# Altium schematic sheet Page08 CPU MISC.SchDoc
size 297 x 209 mm
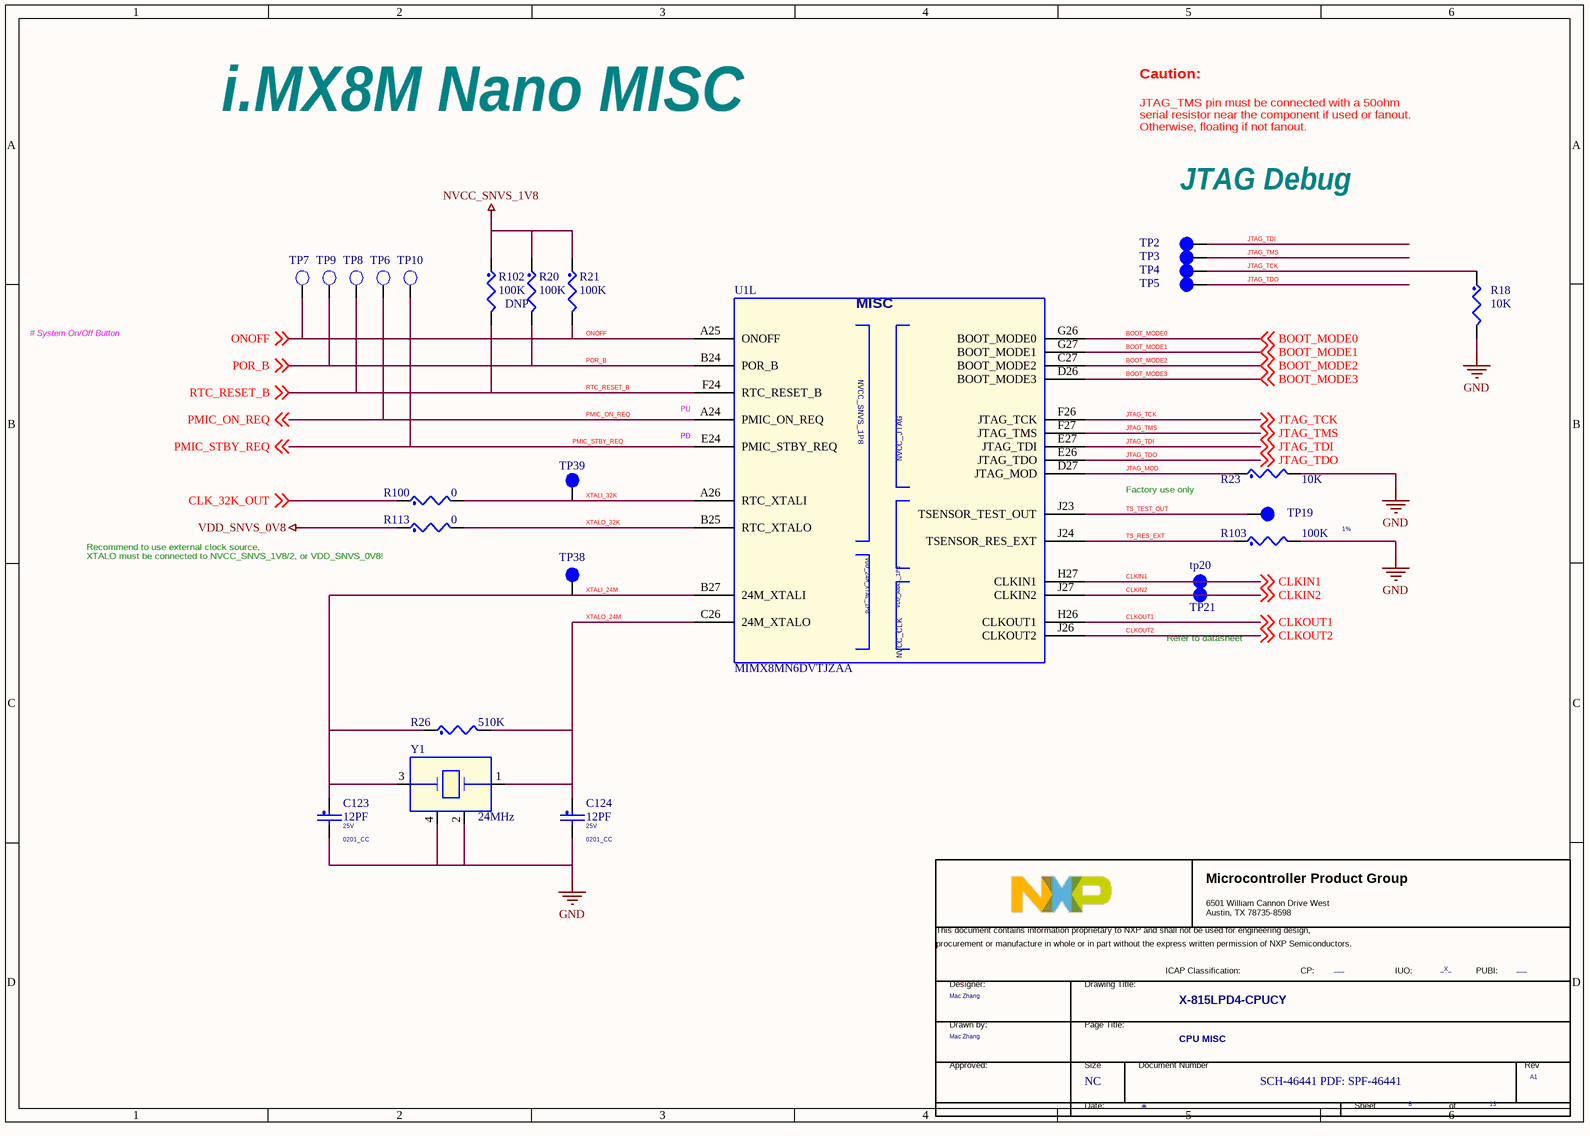
[diagram p0: Page08 CPU MISC.SchDoc]

## Parts
*  Doc: SCH-46441 PDF: SPF-46441  RevCode: A1  Title: X-815LPD4-CPUCY  Page Size: NC  Page Number: 8  Page Count: 13  PageTitle: CPU MISC  Designer: Mac Zhang  PUBI: ___  FIUO: _X_  (hidden comment: TitleBlock_MCPG)  (graphical)
C123  12PF  VOLTAGE: 25V  [0201_CC]
C124  12PF  VOLTAGE: 25V  [0201_CC]
R18  10K  [0201_CC]
R20  100K  [0201_CC]
R21  100K  [0201_CC]
R23  10K  [0201_CC]
R26  510K  [0402_CC]
R100  0  [0402_CC]
R102  100K  ASSY_OPT: DNP  [0201_CC]
R103  100K  Tolerance: 1%  [0201_CC]
R113  0  [0402_CC]
TP2  tpad_020  [tpad_020]  (value not drawn)
TP3  tpad_020  [tpad_020]  (value not drawn)
TP4  tpad_020  [tpad_020]  (value not drawn)
TP5  tpad_020  [tpad_020]  (value not drawn)
TP6  TP_35MIL  [testpoint_35mil]  (value not drawn)
TP7  TP_35MIL  [testpoint_35mil]  (value not drawn)
TP8  TP_35MIL  [testpoint_35mil]  (value not drawn)
TP9  TP_35MIL  [testpoint_35mil]  (value not drawn)
TP10  TP_35MIL  [testpoint_35mil]  (value not drawn)
TP19  tpad_020  [tpad_020]  (value not drawn)
tp20  tpad_020  [tpad_020]  (value not drawn)
TP21  tpad_020  [tpad_020]  (value not drawn)
TP38  tpad_020  [tpad_020]  (value not drawn)
TP39  tpad_020  [tpad_020]  (value not drawn)
U1  MIMX8MN6DVTJZAA  [bga486_0p5_14x14]  (part L of 14)
Y1  24MHz  [xtlosc4_3p2x2p5mm_sm]

## Nets
GND: C123.2 C124.2 R18.2 R23.2 R103.2 Y1.2 Y1.4
NVCC_SNVS_1V8: R20.1 R21.1 R102.1
VDD_SNVS_0V8: R113.1
BOOT_MODE0: U1.G26(BOOT_MODE0) ; off-sheet BOOT_MODE0
BOOT_MODE1: U1.G27(BOOT_MODE1) ; off-sheet BOOT_MODE1
BOOT_MODE2: U1.C27(BOOT_MODE2) ; off-sheet BOOT_MODE2
BOOT_MODE3: U1.D26(BOOT_MODE3) ; off-sheet BOOT_MODE3
CLK_32K_OUT: R100.1 ; off-sheet CLK_32K_OUT
CLKIN1: tp20.1(Pin1) U1.H27(CLKIN1) ; off-sheet CLKIN1
CLKIN2: TP21.1(Pin1) U1.J27(CLKIN2) ; off-sheet CLKIN2
CLKOUT1: U1.H26(CLKOUT1) ; off-sheet CLKOUT1
CLKOUT2: U1.J26(CLKOUT2) ; off-sheet CLKOUT2
JTAG_MOD: R23.1 U1.D27(JTAG_MOD)
JTAG_TCK: R18.1 TP4.1(Pin1) U1.F26(JTAG_TCK) ; off-sheet JTAG_TCK
JTAG_TDI: TP2.1(Pin1) U1.E27(JTAG_TDI) ; off-sheet JTAG_TDI
JTAG_TDO: TP5.1(Pin1) U1.E26(JTAG_TDO) ; off-sheet JTAG_TDO
JTAG_TMS: TP3.1(Pin1) U1.F27(JTAG_TMS) ; off-sheet JTAG_TMS
ONOFF: R21.2 TP7.1(TP) U1.A25(ONOFF) ; off-sheet ONOFF
PMIC_ON_REQ: TP6.1(TP) U1.A24(PMIC_ON_REQ) ; off-sheet PMIC_ON_REQ
PMIC_STBY_REQ: TP10.1(TP) U1.E24(PMIC_STBY_REQ) ; off-sheet PMIC_STBY_REQ
POR_B: R20.2 TP9.1(TP) U1.B24(POR_B) ; off-sheet POR_B
RTC_RESET_B: R102.2 TP8.1(TP) U1.F24(RTC_RESET_B) ; off-sheet RTC_RESET_B
TS_RES_EXT: R103.1 U1.J24(TSENSOR_RES_EXT)
TS_TEST_OUT: TP19.1(Pin1) U1.J23(TSENSOR_TEST_OUT)
XTALI_24M: C123.1 R26.1 TP38.1(Pin1) U1.B27(24M_XTALI) Y1.3
XTALI_32K: R100.2 TP39.1(Pin1) U1.A26(RTC_XTALI)
XTALO_24M: C124.1 R26.2 U1.C26(24M_XTALO) Y1.1
XTALO_32K: R113.2 U1.B25(RTC_XTALO)

## Notes on the sheet
- i.MX8M Nano MISC
- Caution:
- JTAG_TMS pin must be connected with a 50ohm
  serial resistor near the component if used or fanout.
  Otherwise, floating if not fanout.
- JTAG Debug
- # System On/Off Button
- (near U1) PD
- (near U1) PU
- Recommend to use external clock source,
  XTALO must be connected to NVCC_SNVS_1V8/2, or VDD_SNVS_0V8!
- Factory use only
- Refer to datasheet
- (in symbol MIMX8NN_BGA486P, part L) MISC; VDD_ANA1_1P8
- (in symbol TitleBlock_MCPG) Microcontroller Product Group; 6501 William Cannon Drive West / Austin, TX 78735-8598; This document contains information proprietary to NXP and shall not be used for engineering design,; procurement or manufacture in whole or in part without the express written permission of NXP Semiconductors.; ICAP Classification:; CP:; IUO:; PUBI:; Designer:; Drawing Title:; Drawn by:; Page Title:; Approved:; Size; Document Number; Rev; Date:; Sheet; of

## Library data of the parts
* = TitleBlock_MCPG: OrgAddr1: NO. 192 Liangjing Rd. Pudong New Area, ShangHai; OrgName: NXP Semiconductor; Page Create Date: March  8, 1995; DrawnBy: Mac Zhang; FCP: ___; Page Modify Date: *
C123 = CAP_NP: CAP CER 12PF 25V 5% C0G AEC-Q200 0201; CLASS: DISCRETE; AGILE_PN: 150-79813; MFG_NAME01: TDK; MFG_PN01: CGA1A2C0G1E120J030BA; CAD_APPROVED: Yes; FPLIST: CC0201,CC0201_HD,0201_CC; Tolerance: 5%; ROHS: Yes; HEIGHT: 0.33MM; PCB Footprint: 0201_CC
C124 = CAP_NP: CAP CER 12PF 25V 5% C0G AEC-Q200 0201; CLASS: DISCRETE; FPLIST: CC0201,CC0201_HD,0201_CC; CAD_APPROVED: Yes; MFG_PN01: CGA1A2C0G1E120J030BA; MFG_NAME01: TDK; AGILE_PN: 150-79813; HEIGHT: 0.33MM; ROHS: Yes; Tolerance: 5%; PCB Footprint: 0201_CC
R18 = RES: RES MF 10K 1/20W 5% 0201; CLASS: DISCRETE; AGILE_PN: 470-79719; MFG_NAME01: RALEC ELECTRONIC CORP; MFG_PN01: RTT01103JTH; CAD_APPROVED: Yes; FPLIST: RC0201,0201_CC; Tolerance: 5%; ROHS: Yes; HEIGHT: 0.26 MM; PCB Footprint: 0201_CC
R20 R21 R102 R103 = RES: RES MF 100K 1/20W 1% 0201; CLASS: DISCRETE; FPLIST: RC0201,0201_CC; CAD_APPROVED: Yes; MFG_PN01: RC-0201-104FT; MFG_NAME01: SKYMOS; AGILE_PN: 470-77704; HEIGHT: 0.26MM; ROHS: Yes; PCB Footprint: 0201_CC
  R20 R21 R102: Tolerance: 1%
R23 = RES: RES MF 10K 1/20W 5% 0201; CLASS: DISCRETE; FPLIST: RC0201,0201_CC; CAD_APPROVED: Yes; MFG_PN01: RTT01103JTH; MFG_NAME01: RALEC ELECTRONIC CORP; AGILE_PN: 470-79719; HEIGHT: 0.26 MM; ROHS: Yes; Tolerance: 5%; PCB Footprint: 0201_CC
R26 = RES: RES MF 510K 1/16W 5% 0402; CLASS: DISCRETE; AGILE_PN: 470-76166; MFG_NAME01: PANASONIC; MFG_PN01: ERJ-2GEJ514X; CAD_APPROVED: Yes; FPLIST: RC0402_25,RC0402_HD,0402_CC; Tolerance: 5%; ROHS: Yes; HEIGHT: 0.4 MM; PCB Footprint: 0402_CC
R100 R113 = RES: RES MF ZERO OHM 1/16W 5% 0402; CLASS: DISCRETE; FPLIST: RC0402_25,RC0402_HD,RC0402_X2,0402_CC; CAD_APPROVED: Yes; MFG_PN01: MCR01MZPJ000; MFG_NAME01: ROHM; AGILE_PN: 470-75394; VOLTAGE: 1/16W; HEIGHT: 0.45 MM; ROHS: Yes; Tolerance: 5%; PCB Footprint: 0402_CC
TP2 TP4 TP19 TP39 = TESTLOOP: TEST POINT PAD 0.5MM DIA SMT, NO PART TO ORDER; CLASS: IO; ASSY_OPT: DNP; CAD_APPROVED: Yes; AGILE_PN: 211-77484; HEIGHT: 0.1MM; ROHS: Yes; PCB Footprint: tpad_020
TP3 TP5 tp20 TP21 TP38 = TESTLOOP: TEST POINT PAD 0.5MM DIA SMT, NO PART TO ORDER; CLASS: IO; ASSY_OPT: DNP; AGILE_PN: 211-77484; CAD_APPROVED: Yes; ROHS: Yes; HEIGHT: 0.1MM; PCB Footprint: tpad_020
TP6 TP7 TP9 = T POINT R: TEST POINT PAD .035 SMT, no part to order; ASSY_OPT: DNP; CLASS: IC; AGILE_PN: 510-75618; CAD_APPROVED: Yes; PCB Footprint: testpoint_35mil; ROHS: Yes; HEIGHT: 0.1MM
TP8 TP10 = T POINT R: TEST POINT PAD .035 SMT, no part to order; ASSY_OPT: DNP; CLASS: IC; CAD_APPROVED: Yes; AGILE_PN: 510-75618; PCB Footprint: testpoint_35mil; HEIGHT: 0.1MM; ROHS: Yes
U1 = MIMX8NN_BGA486P: IC CPU QUAD CORTEX A53+M7 1.5GHZ BGA486; Temp Range: 0¡ãC to 95¡ãC; CAD_APPROVED: Yes; PRE_APN: 330-77106; MFG_NAME01: NXP SEMICONDUCTORS; AGILE_PN: TMP-WF-35485; CLASS: IC; HEIGHT: 1.25MM; Temp_Range: 0¡ãC to 95¡ãC; ROHS: Yes; MFG_PN01: MIMX8MN6DVTJZAA; PCB Footprint: bga486_0p5_14x14
Y1 = XTAL_13: XTAL 24MHZ 9pF -- SMT 3.2X2.5MM; CLASS: IC; CAD_APPROVED: Yes; MFG_PN01: TSX-3225 24.0000MF15X-AC3; MFG_NAME01: EPSON TOYOCOM CORPORATION; AGILE_PN: 230-77392; HEIGHT: 0.60MM; ROHS: Yes; PCB Footprint: xtlosc4_3p2x2p5mm_sm